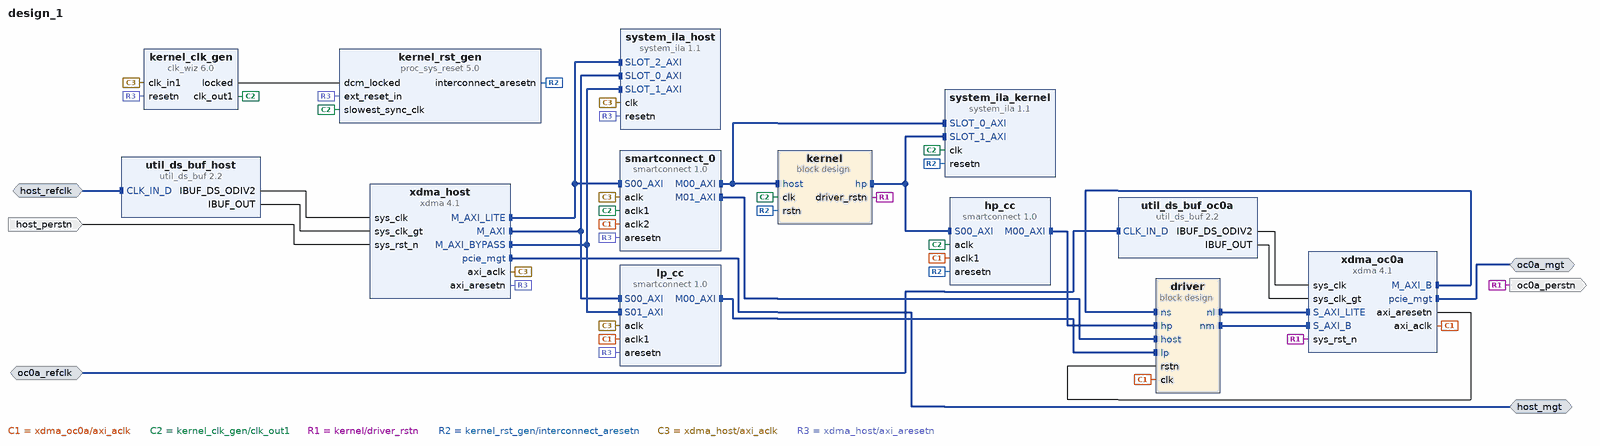
[diagram p0: block diagram of the top level]
# Vivado block design design_1, xczu19eg-ffvd1760-2-e, Vivado 2021.2
create_bd_design design_1

create_bd_intf_port -mode Slave -vlnv xilinx.com:interface:diff_clock_rtl:1.0 host_refclk
create_bd_intf_port -mode Master -vlnv xilinx.com:interface:pcie_7x_mgt_rtl:1.0 host_mgt
create_bd_intf_port -mode Slave -vlnv xilinx.com:interface:diff_clock_rtl:1.0 oc0a_refclk
create_bd_intf_port -mode Master -vlnv xilinx.com:interface:pcie_7x_mgt_rtl:1.0 oc0a_mgt
create_bd_port -dir I -type rst host_perstn
create_bd_port -dir O -type rst oc0a_perstn

create_bd_cell -type ip -vlnv xilinx.com:ip:xdma:4.1 xdma_host
set_property -dict [list \
  CONFIG.PF0_DEVICE_ID_mqdma 903F \
  CONFIG.PF0_SRIOV_VF_DEVICE_ID A03F \
  CONFIG.PF2_DEVICE_ID_mqdma 923F \
  CONFIG.PF3_DEVICE_ID_mqdma 933F \
  CONFIG.axi_bypass_64bit_en true \
  CONFIG.axi_bypass_prefetchable true \
  CONFIG.axi_data_width 512_bit \
  CONFIG.axilite_master_en true \
  CONFIG.axilite_master_size 4 \
  CONFIG.axist_bypass_en true \
  CONFIG.axist_bypass_scale Gigabytes \
  CONFIG.axist_bypass_size 64 \
  CONFIG.axisten_freq 250 \
  CONFIG.en_gt_selection true \
  CONFIG.mode_selection Advanced \
  CONFIG.pf0_device_id 903F \
  CONFIG.pl_link_cap_max_link_speed 8.0_GT/s \
  CONFIG.pl_link_cap_max_link_width X16 \
  CONFIG.plltype QPLL1 \
  CONFIG.select_quad GTH_Quad_227 \
] [get_bd_cells xdma_host]
create_bd_cell -type ip -vlnv xilinx.com:ip:util_ds_buf:2.2 util_ds_buf_host
set_property -dict {CONFIG.C_BUF_TYPE IBUFDSGTE} [get_bd_cells util_ds_buf_host]
create_bd_cell -type ip -vlnv xilinx.com:ip:xdma:4.1 xdma_oc0a
set_property -dict [list \
  CONFIG.BASEADDR 0x00000000 \
  CONFIG.HIGHADDR 0x001FFFFF \
  CONFIG.PF0_DEVICE_ID_mqdma 9034 \
  CONFIG.PF0_SRIOV_VF_DEVICE_ID A034 \
  CONFIG.PF2_DEVICE_ID_mqdma 9234 \
  CONFIG.PF3_DEVICE_ID_mqdma 9334 \
  CONFIG.axi_addr_width 32 \
  CONFIG.axi_data_width 128_bit \
  CONFIG.axisten_freq 250 \
  CONFIG.bridge_burst true \
  CONFIG.device_port_type Root_Port_of_PCI_Express_Root_Complex \
  CONFIG.dma_reset_source_sel Phy_Ready \
  CONFIG.en_gt_selection true \
  CONFIG.functional_mode AXI_Bridge \
  CONFIG.mode_selection Advanced \
  CONFIG.pcie_blk_locn X0Y3 \
  CONFIG.pf0_bar0_enabled false \
  CONFIG.pf0_bar0_type_mqdma Memory \
  CONFIG.pf0_base_class_menu Bridge_device \
  CONFIG.pf0_base_class_menu_mqdma Bridge_device \
  CONFIG.pf0_class_code_base_mqdma 06 \
  CONFIG.pf0_class_code_interface 00 \
  CONFIG.pf0_class_code_sub 07 \
  CONFIG.pf0_device_id 9134 \
  CONFIG.pf0_sriov_bar0_type Memory \
  CONFIG.pf0_sub_class_interface_menu CardBus_bridge \
  CONFIG.pf1_bar0_type_mqdma Memory \
  CONFIG.pf1_base_class_menu Bridge_device \
  CONFIG.pf1_base_class_menu_mqdma Bridge_device \
  CONFIG.pf1_class_code_base_mqdma 06 \
  CONFIG.pf1_class_code_interface 00 \
  CONFIG.pf1_class_code_sub 07 \
  CONFIG.pf1_sub_class_interface_menu CardBus_bridge \
  CONFIG.pf2_bar0_type_mqdma Memory \
  CONFIG.pf2_base_class_menu_mqdma Bridge_device \
  CONFIG.pf2_class_code_base_mqdma 06 \
  CONFIG.pf3_bar0_type_mqdma Memory \
  CONFIG.pf3_base_class_menu_mqdma Bridge_device \
  CONFIG.pf3_class_code_base_mqdma 06 \
  CONFIG.pl_link_cap_max_link_speed 8.0_GT/s \
  CONFIG.pl_link_cap_max_link_width X4 \
  CONFIG.plltype QPLL1 \
  CONFIG.select_quad GTY_Quad_131 \
  CONFIG.type1_membase_memlimit_enable Enabled \
  CONFIG.type1_prefetchable_membase_memlimit 64bit_Enabled \
] [get_bd_cells xdma_oc0a]
create_bd_cell -type ip -vlnv xilinx.com:ip:util_ds_buf:2.2 util_ds_buf_oc0a
set_property -dict {CONFIG.C_BUF_TYPE IBUFDSGTE} [get_bd_cells util_ds_buf_oc0a]
create_bd_cell -type ip -vlnv xilinx.com:ip:clk_wiz:6.0 kernel_clk_gen
set_property -dict [list \
  CONFIG.CLKOUT1_JITTER 85.152 \
  CONFIG.CLKOUT1_PHASE_ERROR 78.266 \
  CONFIG.CLKOUT1_REQUESTED_OUT_FREQ 250 \
  CONFIG.MMCM_CLKFBOUT_MULT_F 4.750 \
  CONFIG.MMCM_CLKOUT0_DIVIDE_F 4.750 \
  CONFIG.RESET_PORT resetn \
  CONFIG.RESET_TYPE ACTIVE_LOW \
  CONFIG.USE_RESET true \
] [get_bd_cells kernel_clk_gen]
create_bd_cell -type ip -vlnv xilinx.com:ip:proc_sys_reset:5.0 kernel_rst_gen
set_property -dict {CONFIG.C_EXT_RST_WIDTH 1} [get_bd_cells kernel_rst_gen]
create_bd_cell -type container -reference design_2 kernel
set_property -dict [list \
  CONFIG.ACTIVE_SIM_BD design_2.bd \
  CONFIG.ACTIVE_SYNTH_BD design_2.bd \
  CONFIG.ENABLE_DFX 0 \
  CONFIG.LIST_SIM_BD design_2.bd \
  CONFIG.LIST_SYNTH_BD design_2.bd \
  CONFIG.LOCK_PROPAGATE 0 \
] [get_bd_cells kernel]
create_bd_cell -type container -reference design_3 driver
set_property -dict [list \
  CONFIG.ACTIVE_SIM_BD design_3.bd \
  CONFIG.ACTIVE_SYNTH_BD design_3.bd \
  CONFIG.ENABLE_DFX 0 \
  CONFIG.LIST_SIM_BD design_3.bd \
  CONFIG.LIST_SYNTH_BD design_3.bd \
  CONFIG.LOCK_PROPAGATE 0 \
] [get_bd_cells driver]
create_bd_cell -type ip -vlnv xilinx.com:ip:smartconnect:1.0 lp_cc
set_property -dict {CONFIG.HAS_ARESETN 1 CONFIG.NUM_CLKS 2} [get_bd_cells lp_cc]
create_bd_cell -type ip -vlnv xilinx.com:ip:smartconnect:1.0 hp_cc
set_property -dict {CONFIG.NUM_CLKS 2 CONFIG.NUM_SI 1} [get_bd_cells hp_cc]
create_bd_cell -type ip -vlnv xilinx.com:ip:system_ila:1.1 system_ila_host
set_property -dict {CONFIG.C_NUM_MONITOR_SLOTS 3 CONFIG.C_SLOT 1} [get_bd_cells system_ila_host]
create_bd_cell -type ip -vlnv xilinx.com:ip:system_ila:1.1 system_ila_kernel
set_property -dict {CONFIG.C_NUM_MONITOR_SLOTS 2} [get_bd_cells system_ila_kernel]
create_bd_cell -type ip -vlnv xilinx.com:ip:smartconnect:1.0 smartconnect_0
set_property -dict {CONFIG.NUM_CLKS 3 CONFIG.NUM_MI 2 CONFIG.NUM_SI 1} [get_bd_cells smartconnect_0]

# ---- connections ----

connect_bd_intf_net -intf_net CLK_IN_D_0_1 [get_bd_intf_ports host_refclk] [get_bd_intf_pins util_ds_buf_host/CLK_IN_D]
connect_bd_intf_net -intf_net CLK_IN_D_0_2 [get_bd_intf_ports oc0a_refclk] [get_bd_intf_pins util_ds_buf_oc0a/CLK_IN_D]
connect_bd_intf_net -intf_net design_3_0_nl [get_bd_intf_pins driver/nl] [get_bd_intf_pins xdma_oc0a/S_AXI_LITE]
connect_bd_intf_net -intf_net design_3_0_nm [get_bd_intf_pins driver/nm] [get_bd_intf_pins xdma_oc0a/S_AXI_B]
connect_bd_intf_net -intf_net hp_cc2_M00_AXI [get_bd_intf_pins hp_cc/M00_AXI] [get_bd_intf_pins driver/hp]
connect_bd_intf_net [get_bd_intf_pins hp_cc/S00_AXI] [get_bd_intf_pins kernel/hp]
connect_bd_intf_net [get_bd_intf_pins hp_cc/S00_AXI] [get_bd_intf_pins system_ila_kernel/SLOT_1_AXI]
connect_bd_intf_net [get_bd_intf_pins driver/ns] [get_bd_intf_pins xdma_oc0a/M_AXI_B]
connect_bd_intf_net -intf_net smartconnect_0_M00_AXI [get_bd_intf_pins lp_cc/M00_AXI] [get_bd_intf_pins driver/lp]
connect_bd_intf_net [get_bd_intf_pins smartconnect_0/M00_AXI] [get_bd_intf_pins kernel/host]
connect_bd_intf_net [get_bd_intf_pins smartconnect_0/M00_AXI] [get_bd_intf_pins system_ila_kernel/SLOT_0_AXI]
connect_bd_intf_net [get_bd_intf_pins smartconnect_0/M01_AXI] [get_bd_intf_pins driver/host]
connect_bd_intf_net -intf_net xdma_0_pcie_mgt [get_bd_intf_ports host_mgt] [get_bd_intf_pins xdma_host/pcie_mgt]
connect_bd_intf_net -intf_net xdma_1_pcie_mgt [get_bd_intf_ports oc0a_mgt] [get_bd_intf_pins xdma_oc0a/pcie_mgt]
connect_bd_intf_net [get_bd_intf_pins lp_cc/S00_AXI] [get_bd_intf_pins xdma_host/M_AXI]
connect_bd_intf_net [get_bd_intf_pins lp_cc/S00_AXI] [get_bd_intf_pins system_ila_host/SLOT_0_AXI]
connect_bd_intf_net [get_bd_intf_pins lp_cc/S01_AXI] [get_bd_intf_pins xdma_host/M_AXI_BYPASS]
connect_bd_intf_net [get_bd_intf_pins lp_cc/S01_AXI] [get_bd_intf_pins system_ila_host/SLOT_1_AXI]
connect_bd_intf_net [get_bd_intf_pins smartconnect_0/S00_AXI] [get_bd_intf_pins xdma_host/M_AXI_LITE]
connect_bd_intf_net [get_bd_intf_pins smartconnect_0/S00_AXI] [get_bd_intf_pins system_ila_host/SLOT_2_AXI]
connect_bd_net -net clk_1 [get_bd_pins xdma_oc0a/axi_aclk] \
  [get_bd_pins driver/clk] [get_bd_pins lp_cc/aclk1] [get_bd_pins hp_cc/aclk1] [get_bd_pins smartconnect_0/aclk2]
connect_bd_net -net clk_wiz_0_clk_out1 [get_bd_pins kernel_clk_gen/clk_out1] \
  [get_bd_pins kernel_rst_gen/slowest_sync_clk] [get_bd_pins kernel/clk] [get_bd_pins hp_cc/aclk] \
  [get_bd_pins system_ila_kernel/clk] [get_bd_pins smartconnect_0/aclk1]
connect_bd_net -net clk_wiz_0_locked [get_bd_pins kernel_clk_gen/locked] [get_bd_pins kernel_rst_gen/dcm_locked]
connect_bd_net -net kernel_wrapper_0_driver_rstn [get_bd_pins kernel/driver_rstn] [get_bd_ports oc0a_perstn] [get_bd_pins xdma_oc0a/sys_rst_n]
connect_bd_net -net proc_sys_reset_0_interconnect_aresetn [get_bd_pins kernel_rst_gen/interconnect_aresetn] \
  [get_bd_pins kernel/rstn] [get_bd_pins hp_cc/aresetn] [get_bd_pins system_ila_kernel/resetn]
connect_bd_net -net rstn_1 [get_bd_pins xdma_oc0a/axi_aresetn] [get_bd_pins driver/rstn]
connect_bd_net -net sys_rst_n_0_1 [get_bd_ports host_perstn] [get_bd_pins xdma_host/sys_rst_n]
connect_bd_net -net util_ds_buf_0_IBUF_DS_ODIV2 [get_bd_pins util_ds_buf_host/IBUF_DS_ODIV2] [get_bd_pins xdma_host/sys_clk]
connect_bd_net -net util_ds_buf_0_IBUF_OUT [get_bd_pins util_ds_buf_host/IBUF_OUT] [get_bd_pins xdma_host/sys_clk_gt]
connect_bd_net -net util_ds_buf_1_IBUF_DS_ODIV2 [get_bd_pins util_ds_buf_oc0a/IBUF_DS_ODIV2] [get_bd_pins xdma_oc0a/sys_clk]
connect_bd_net -net util_ds_buf_1_IBUF_OUT [get_bd_pins util_ds_buf_oc0a/IBUF_OUT] [get_bd_pins xdma_oc0a/sys_clk_gt]
connect_bd_net -net xdma_0_axi_aclk [get_bd_pins xdma_host/axi_aclk] \
  [get_bd_pins kernel_clk_gen/clk_in1] [get_bd_pins lp_cc/aclk] [get_bd_pins system_ila_host/clk] \
  [get_bd_pins smartconnect_0/aclk]
connect_bd_net -net xdma_0_axi_aresetn [get_bd_pins xdma_host/axi_aresetn] \
  [get_bd_pins kernel_rst_gen/ext_reset_in] [get_bd_pins kernel_clk_gen/resetn] [get_bd_pins lp_cc/aresetn] \
  [get_bd_pins system_ila_host/resetn] [get_bd_pins smartconnect_0/aresetn]

# ---- address map ----
assign_bd_address -offset 0x000800000 -range 2M -target_address_space [get_bd_addr_spaces driver/driver_wrapper_0/rdbuf] [get_bd_addr_segs driver/rdbuf_ctrl/S_AXI/Mem0]
exclude_bd_addr_seg -offset 0x000000000 -range 2M -target_address_space [get_bd_addr_spaces driver/driver_wrapper_0/rdbuf] [get_bd_addr_segs driver/wrsq_ctrl/S_AXI/Mem0]
exclude_bd_addr_seg -offset 0x000200000 -range 2M -target_address_space [get_bd_addr_spaces driver/driver_wrapper_0/rdbuf] [get_bd_addr_segs driver/wrbuf_ctrl/S_AXI/Mem0]
exclude_bd_addr_seg -offset 0x000400000 -range 2M -target_address_space [get_bd_addr_spaces driver/driver_wrapper_0/rdbuf] [get_bd_addr_segs driver/wrcq_ctrl/S_AXI/Mem0]
exclude_bd_addr_seg -offset 0x000600000 -range 2M -target_address_space [get_bd_addr_spaces driver/driver_wrapper_0/rdbuf] [get_bd_addr_segs driver/rdsq_ctrl/S_AXI/Mem0]
exclude_bd_addr_seg -offset 0x000A00000 -range 2M -target_address_space [get_bd_addr_spaces driver/driver_wrapper_0/rdbuf] [get_bd_addr_segs driver/rdcq_ctrl/S_AXI/Mem0]
exclude_bd_addr_seg -offset 0x000C00000 -range 2M -target_address_space [get_bd_addr_spaces driver/driver_wrapper_0/rdbuf] [get_bd_addr_segs driver/adbuf_ctrl/S_AXI/Mem0]
exclude_bd_addr_seg -offset 0x200000000 -range 4G -target_address_space [get_bd_addr_spaces driver/driver_wrapper_0/rdbuf] [get_bd_addr_segs xdma_oc0a/S_AXI_LITE/CTL0]
exclude_bd_addr_seg -offset 0x300000000 -range 4G -target_address_space [get_bd_addr_spaces driver/driver_wrapper_0/rdbuf] [get_bd_addr_segs xdma_oc0a/S_AXI_B/BAR0]
assign_bd_address -offset 0x000A00000 -range 2M -target_address_space [get_bd_addr_spaces driver/driver_wrapper_0/rdcq] [get_bd_addr_segs driver/rdcq_ctrl/S_AXI/Mem0]
exclude_bd_addr_seg -offset 0x000000000 -range 2M -target_address_space [get_bd_addr_spaces driver/driver_wrapper_0/rdcq] [get_bd_addr_segs driver/wrsq_ctrl/S_AXI/Mem0]
exclude_bd_addr_seg -offset 0x000200000 -range 2M -target_address_space [get_bd_addr_spaces driver/driver_wrapper_0/rdcq] [get_bd_addr_segs driver/wrbuf_ctrl/S_AXI/Mem0]
exclude_bd_addr_seg -offset 0x000400000 -range 2M -target_address_space [get_bd_addr_spaces driver/driver_wrapper_0/rdcq] [get_bd_addr_segs driver/wrcq_ctrl/S_AXI/Mem0]
exclude_bd_addr_seg -offset 0x000600000 -range 2M -target_address_space [get_bd_addr_spaces driver/driver_wrapper_0/rdcq] [get_bd_addr_segs driver/rdsq_ctrl/S_AXI/Mem0]
exclude_bd_addr_seg -offset 0x000800000 -range 2M -target_address_space [get_bd_addr_spaces driver/driver_wrapper_0/rdcq] [get_bd_addr_segs driver/rdbuf_ctrl/S_AXI/Mem0]
exclude_bd_addr_seg -offset 0x000C00000 -range 2M -target_address_space [get_bd_addr_spaces driver/driver_wrapper_0/rdcq] [get_bd_addr_segs driver/adbuf_ctrl/S_AXI/Mem0]
exclude_bd_addr_seg -offset 0x200000000 -range 4G -target_address_space [get_bd_addr_spaces driver/driver_wrapper_0/rdcq] [get_bd_addr_segs xdma_oc0a/S_AXI_LITE/CTL0]
exclude_bd_addr_seg -offset 0x300000000 -range 4G -target_address_space [get_bd_addr_spaces driver/driver_wrapper_0/rdcq] [get_bd_addr_segs xdma_oc0a/S_AXI_B/BAR0]
assign_bd_address -offset 0x300000000 -range 4G -target_address_space [get_bd_addr_spaces driver/driver_wrapper_0/rdcqdb] [get_bd_addr_segs xdma_oc0a/S_AXI_B/BAR0]
exclude_bd_addr_seg -offset 0x000000000 -range 2M -target_address_space [get_bd_addr_spaces driver/driver_wrapper_0/rdcqdb] [get_bd_addr_segs driver/wrsq_ctrl/S_AXI/Mem0]
exclude_bd_addr_seg -offset 0x000200000 -range 2M -target_address_space [get_bd_addr_spaces driver/driver_wrapper_0/rdcqdb] [get_bd_addr_segs driver/wrbuf_ctrl/S_AXI/Mem0]
exclude_bd_addr_seg -offset 0x000400000 -range 2M -target_address_space [get_bd_addr_spaces driver/driver_wrapper_0/rdcqdb] [get_bd_addr_segs driver/wrcq_ctrl/S_AXI/Mem0]
exclude_bd_addr_seg -offset 0x000600000 -range 2M -target_address_space [get_bd_addr_spaces driver/driver_wrapper_0/rdcqdb] [get_bd_addr_segs driver/rdsq_ctrl/S_AXI/Mem0]
exclude_bd_addr_seg -offset 0x000800000 -range 2M -target_address_space [get_bd_addr_spaces driver/driver_wrapper_0/rdcqdb] [get_bd_addr_segs driver/rdbuf_ctrl/S_AXI/Mem0]
exclude_bd_addr_seg -offset 0x000A00000 -range 2M -target_address_space [get_bd_addr_spaces driver/driver_wrapper_0/rdcqdb] [get_bd_addr_segs driver/rdcq_ctrl/S_AXI/Mem0]
exclude_bd_addr_seg -offset 0x000C00000 -range 2M -target_address_space [get_bd_addr_spaces driver/driver_wrapper_0/rdcqdb] [get_bd_addr_segs driver/adbuf_ctrl/S_AXI/Mem0]
exclude_bd_addr_seg -offset 0x200000000 -range 4G -target_address_space [get_bd_addr_spaces driver/driver_wrapper_0/rdcqdb] [get_bd_addr_segs xdma_oc0a/S_AXI_LITE/CTL0]
assign_bd_address -offset 0x000600000 -range 2M -target_address_space [get_bd_addr_spaces driver/driver_wrapper_0/rdsq] [get_bd_addr_segs driver/rdsq_ctrl/S_AXI/Mem0]
exclude_bd_addr_seg -offset 0x000000000 -range 2M -target_address_space [get_bd_addr_spaces driver/driver_wrapper_0/rdsq] [get_bd_addr_segs driver/wrsq_ctrl/S_AXI/Mem0]
exclude_bd_addr_seg -offset 0x000200000 -range 2M -target_address_space [get_bd_addr_spaces driver/driver_wrapper_0/rdsq] [get_bd_addr_segs driver/wrbuf_ctrl/S_AXI/Mem0]
exclude_bd_addr_seg -offset 0x000400000 -range 2M -target_address_space [get_bd_addr_spaces driver/driver_wrapper_0/rdsq] [get_bd_addr_segs driver/wrcq_ctrl/S_AXI/Mem0]
exclude_bd_addr_seg -offset 0x000800000 -range 2M -target_address_space [get_bd_addr_spaces driver/driver_wrapper_0/rdsq] [get_bd_addr_segs driver/rdbuf_ctrl/S_AXI/Mem0]
exclude_bd_addr_seg -offset 0x000A00000 -range 2M -target_address_space [get_bd_addr_spaces driver/driver_wrapper_0/rdsq] [get_bd_addr_segs driver/rdcq_ctrl/S_AXI/Mem0]
exclude_bd_addr_seg -offset 0x000C00000 -range 2M -target_address_space [get_bd_addr_spaces driver/driver_wrapper_0/rdsq] [get_bd_addr_segs driver/adbuf_ctrl/S_AXI/Mem0]
exclude_bd_addr_seg -offset 0x200000000 -range 4G -target_address_space [get_bd_addr_spaces driver/driver_wrapper_0/rdsq] [get_bd_addr_segs xdma_oc0a/S_AXI_LITE/CTL0]
exclude_bd_addr_seg -offset 0x300000000 -range 4G -target_address_space [get_bd_addr_spaces driver/driver_wrapper_0/rdsq] [get_bd_addr_segs xdma_oc0a/S_AXI_B/BAR0]
assign_bd_address -offset 0x300000000 -range 4G -target_address_space [get_bd_addr_spaces driver/driver_wrapper_0/rdsqdb] [get_bd_addr_segs xdma_oc0a/S_AXI_B/BAR0]
exclude_bd_addr_seg -offset 0x000000000 -range 2M -target_address_space [get_bd_addr_spaces driver/driver_wrapper_0/rdsqdb] [get_bd_addr_segs driver/wrsq_ctrl/S_AXI/Mem0]
exclude_bd_addr_seg -offset 0x000200000 -range 2M -target_address_space [get_bd_addr_spaces driver/driver_wrapper_0/rdsqdb] [get_bd_addr_segs driver/wrbuf_ctrl/S_AXI/Mem0]
exclude_bd_addr_seg -offset 0x000400000 -range 2M -target_address_space [get_bd_addr_spaces driver/driver_wrapper_0/rdsqdb] [get_bd_addr_segs driver/wrcq_ctrl/S_AXI/Mem0]
exclude_bd_addr_seg -offset 0x000600000 -range 2M -target_address_space [get_bd_addr_spaces driver/driver_wrapper_0/rdsqdb] [get_bd_addr_segs driver/rdsq_ctrl/S_AXI/Mem0]
exclude_bd_addr_seg -offset 0x000800000 -range 2M -target_address_space [get_bd_addr_spaces driver/driver_wrapper_0/rdsqdb] [get_bd_addr_segs driver/rdbuf_ctrl/S_AXI/Mem0]
exclude_bd_addr_seg -offset 0x000A00000 -range 2M -target_address_space [get_bd_addr_spaces driver/driver_wrapper_0/rdsqdb] [get_bd_addr_segs driver/rdcq_ctrl/S_AXI/Mem0]
exclude_bd_addr_seg -offset 0x000C00000 -range 2M -target_address_space [get_bd_addr_spaces driver/driver_wrapper_0/rdsqdb] [get_bd_addr_segs driver/adbuf_ctrl/S_AXI/Mem0]
exclude_bd_addr_seg -offset 0x200000000 -range 4G -target_address_space [get_bd_addr_spaces driver/driver_wrapper_0/rdsqdb] [get_bd_addr_segs xdma_oc0a/S_AXI_LITE/CTL0]
assign_bd_address -offset 0x000200000 -range 2M -target_address_space [get_bd_addr_spaces driver/driver_wrapper_0/wrbuf] [get_bd_addr_segs driver/wrbuf_ctrl/S_AXI/Mem0]
exclude_bd_addr_seg -offset 0x000000000 -range 2M -target_address_space [get_bd_addr_spaces driver/driver_wrapper_0/wrbuf] [get_bd_addr_segs driver/wrsq_ctrl/S_AXI/Mem0]
exclude_bd_addr_seg -offset 0x000400000 -range 2M -target_address_space [get_bd_addr_spaces driver/driver_wrapper_0/wrbuf] [get_bd_addr_segs driver/wrcq_ctrl/S_AXI/Mem0]
exclude_bd_addr_seg -offset 0x000600000 -range 2M -target_address_space [get_bd_addr_spaces driver/driver_wrapper_0/wrbuf] [get_bd_addr_segs driver/rdsq_ctrl/S_AXI/Mem0]
exclude_bd_addr_seg -offset 0x000800000 -range 2M -target_address_space [get_bd_addr_spaces driver/driver_wrapper_0/wrbuf] [get_bd_addr_segs driver/rdbuf_ctrl/S_AXI/Mem0]
exclude_bd_addr_seg -offset 0x000A00000 -range 2M -target_address_space [get_bd_addr_spaces driver/driver_wrapper_0/wrbuf] [get_bd_addr_segs driver/rdcq_ctrl/S_AXI/Mem0]
exclude_bd_addr_seg -offset 0x000C00000 -range 2M -target_address_space [get_bd_addr_spaces driver/driver_wrapper_0/wrbuf] [get_bd_addr_segs driver/adbuf_ctrl/S_AXI/Mem0]
exclude_bd_addr_seg -offset 0x200000000 -range 4G -target_address_space [get_bd_addr_spaces driver/driver_wrapper_0/wrbuf] [get_bd_addr_segs xdma_oc0a/S_AXI_LITE/CTL0]
exclude_bd_addr_seg -offset 0x300000000 -range 4G -target_address_space [get_bd_addr_spaces driver/driver_wrapper_0/wrbuf] [get_bd_addr_segs xdma_oc0a/S_AXI_B/BAR0]
assign_bd_address -offset 0x000400000 -range 2M -target_address_space [get_bd_addr_spaces driver/driver_wrapper_0/wrcq] [get_bd_addr_segs driver/wrcq_ctrl/S_AXI/Mem0]
exclude_bd_addr_seg -offset 0x000000000 -range 2M -target_address_space [get_bd_addr_spaces driver/driver_wrapper_0/wrcq] [get_bd_addr_segs driver/wrsq_ctrl/S_AXI/Mem0]
exclude_bd_addr_seg -offset 0x000200000 -range 2M -target_address_space [get_bd_addr_spaces driver/driver_wrapper_0/wrcq] [get_bd_addr_segs driver/wrbuf_ctrl/S_AXI/Mem0]
exclude_bd_addr_seg -offset 0x000600000 -range 2M -target_address_space [get_bd_addr_spaces driver/driver_wrapper_0/wrcq] [get_bd_addr_segs driver/rdsq_ctrl/S_AXI/Mem0]
exclude_bd_addr_seg -offset 0x000800000 -range 2M -target_address_space [get_bd_addr_spaces driver/driver_wrapper_0/wrcq] [get_bd_addr_segs driver/rdbuf_ctrl/S_AXI/Mem0]
exclude_bd_addr_seg -offset 0x000A00000 -range 2M -target_address_space [get_bd_addr_spaces driver/driver_wrapper_0/wrcq] [get_bd_addr_segs driver/rdcq_ctrl/S_AXI/Mem0]
exclude_bd_addr_seg -offset 0x000C00000 -range 2M -target_address_space [get_bd_addr_spaces driver/driver_wrapper_0/wrcq] [get_bd_addr_segs driver/adbuf_ctrl/S_AXI/Mem0]
exclude_bd_addr_seg -offset 0x200000000 -range 4G -target_address_space [get_bd_addr_spaces driver/driver_wrapper_0/wrcq] [get_bd_addr_segs xdma_oc0a/S_AXI_LITE/CTL0]
exclude_bd_addr_seg -offset 0x300000000 -range 4G -target_address_space [get_bd_addr_spaces driver/driver_wrapper_0/wrcq] [get_bd_addr_segs xdma_oc0a/S_AXI_B/BAR0]
assign_bd_address -offset 0x300000000 -range 4G -target_address_space [get_bd_addr_spaces driver/driver_wrapper_0/wrcqdb] [get_bd_addr_segs xdma_oc0a/S_AXI_B/BAR0]
exclude_bd_addr_seg -offset 0x000000000 -range 2M -target_address_space [get_bd_addr_spaces driver/driver_wrapper_0/wrcqdb] [get_bd_addr_segs driver/wrsq_ctrl/S_AXI/Mem0]
exclude_bd_addr_seg -offset 0x000200000 -range 2M -target_address_space [get_bd_addr_spaces driver/driver_wrapper_0/wrcqdb] [get_bd_addr_segs driver/wrbuf_ctrl/S_AXI/Mem0]
exclude_bd_addr_seg -offset 0x000400000 -range 2M -target_address_space [get_bd_addr_spaces driver/driver_wrapper_0/wrcqdb] [get_bd_addr_segs driver/wrcq_ctrl/S_AXI/Mem0]
exclude_bd_addr_seg -offset 0x000600000 -range 2M -target_address_space [get_bd_addr_spaces driver/driver_wrapper_0/wrcqdb] [get_bd_addr_segs driver/rdsq_ctrl/S_AXI/Mem0]
exclude_bd_addr_seg -offset 0x000800000 -range 2M -target_address_space [get_bd_addr_spaces driver/driver_wrapper_0/wrcqdb] [get_bd_addr_segs driver/rdbuf_ctrl/S_AXI/Mem0]
exclude_bd_addr_seg -offset 0x000A00000 -range 2M -target_address_space [get_bd_addr_spaces driver/driver_wrapper_0/wrcqdb] [get_bd_addr_segs driver/rdcq_ctrl/S_AXI/Mem0]
exclude_bd_addr_seg -offset 0x000C00000 -range 2M -target_address_space [get_bd_addr_spaces driver/driver_wrapper_0/wrcqdb] [get_bd_addr_segs driver/adbuf_ctrl/S_AXI/Mem0]
exclude_bd_addr_seg -offset 0x200000000 -range 4G -target_address_space [get_bd_addr_spaces driver/driver_wrapper_0/wrcqdb] [get_bd_addr_segs xdma_oc0a/S_AXI_LITE/CTL0]
assign_bd_address -offset 0x000000000 -range 2M -target_address_space [get_bd_addr_spaces driver/driver_wrapper_0/wrsq] [get_bd_addr_segs driver/wrsq_ctrl/S_AXI/Mem0]
exclude_bd_addr_seg -offset 0x000200000 -range 2M -target_address_space [get_bd_addr_spaces driver/driver_wrapper_0/wrsq] [get_bd_addr_segs driver/wrbuf_ctrl/S_AXI/Mem0]
exclude_bd_addr_seg -offset 0x000400000 -range 2M -target_address_space [get_bd_addr_spaces driver/driver_wrapper_0/wrsq] [get_bd_addr_segs driver/wrcq_ctrl/S_AXI/Mem0]
exclude_bd_addr_seg -offset 0x000600000 -range 2M -target_address_space [get_bd_addr_spaces driver/driver_wrapper_0/wrsq] [get_bd_addr_segs driver/rdsq_ctrl/S_AXI/Mem0]
exclude_bd_addr_seg -offset 0x000800000 -range 2M -target_address_space [get_bd_addr_spaces driver/driver_wrapper_0/wrsq] [get_bd_addr_segs driver/rdbuf_ctrl/S_AXI/Mem0]
exclude_bd_addr_seg -offset 0x000A00000 -range 2M -target_address_space [get_bd_addr_spaces driver/driver_wrapper_0/wrsq] [get_bd_addr_segs driver/rdcq_ctrl/S_AXI/Mem0]
exclude_bd_addr_seg -offset 0x000C00000 -range 2M -target_address_space [get_bd_addr_spaces driver/driver_wrapper_0/wrsq] [get_bd_addr_segs driver/adbuf_ctrl/S_AXI/Mem0]
exclude_bd_addr_seg -offset 0x200000000 -range 4G -target_address_space [get_bd_addr_spaces driver/driver_wrapper_0/wrsq] [get_bd_addr_segs xdma_oc0a/S_AXI_LITE/CTL0]
exclude_bd_addr_seg -offset 0x300000000 -range 4G -target_address_space [get_bd_addr_spaces driver/driver_wrapper_0/wrsq] [get_bd_addr_segs xdma_oc0a/S_AXI_B/BAR0]
assign_bd_address -offset 0x300000000 -range 4G -target_address_space [get_bd_addr_spaces driver/driver_wrapper_0/wrsqdb] [get_bd_addr_segs xdma_oc0a/S_AXI_B/BAR0]
exclude_bd_addr_seg -offset 0x000000000 -range 2M -target_address_space [get_bd_addr_spaces driver/driver_wrapper_0/wrsqdb] [get_bd_addr_segs driver/wrsq_ctrl/S_AXI/Mem0]
exclude_bd_addr_seg -offset 0x000200000 -range 2M -target_address_space [get_bd_addr_spaces driver/driver_wrapper_0/wrsqdb] [get_bd_addr_segs driver/wrbuf_ctrl/S_AXI/Mem0]
exclude_bd_addr_seg -offset 0x000400000 -range 2M -target_address_space [get_bd_addr_spaces driver/driver_wrapper_0/wrsqdb] [get_bd_addr_segs driver/wrcq_ctrl/S_AXI/Mem0]
exclude_bd_addr_seg -offset 0x000600000 -range 2M -target_address_space [get_bd_addr_spaces driver/driver_wrapper_0/wrsqdb] [get_bd_addr_segs driver/rdsq_ctrl/S_AXI/Mem0]
exclude_bd_addr_seg -offset 0x000800000 -range 2M -target_address_space [get_bd_addr_spaces driver/driver_wrapper_0/wrsqdb] [get_bd_addr_segs driver/rdbuf_ctrl/S_AXI/Mem0]
exclude_bd_addr_seg -offset 0x000A00000 -range 2M -target_address_space [get_bd_addr_spaces driver/driver_wrapper_0/wrsqdb] [get_bd_addr_segs driver/rdcq_ctrl/S_AXI/Mem0]
exclude_bd_addr_seg -offset 0x000C00000 -range 2M -target_address_space [get_bd_addr_spaces driver/driver_wrapper_0/wrsqdb] [get_bd_addr_segs driver/adbuf_ctrl/S_AXI/Mem0]
exclude_bd_addr_seg -offset 0x200000000 -range 4G -target_address_space [get_bd_addr_spaces driver/driver_wrapper_0/wrsqdb] [get_bd_addr_segs xdma_oc0a/S_AXI_LITE/CTL0]
assign_bd_address -offset 0x000000000000 -range 256T -target_address_space [get_bd_addr_spaces kernel/kernel_wrapper_0/hp] [get_bd_addr_segs driver/driver_wrapper_0/hp/reg0]
assign_bd_address -offset 0x0000000000000000 -range 2M -target_address_space [get_bd_addr_spaces xdma_host/M_AXI] [get_bd_addr_segs driver/wrsq_ctrl/S_AXI/Mem0]
assign_bd_address -offset 0x0000000000200000 -range 2M -target_address_space [get_bd_addr_spaces xdma_host/M_AXI] [get_bd_addr_segs driver/wrbuf_ctrl/S_AXI/Mem0]
assign_bd_address -offset 0x0000000000400000 -range 2M -target_address_space [get_bd_addr_spaces xdma_host/M_AXI] [get_bd_addr_segs driver/wrcq_ctrl/S_AXI/Mem0]
assign_bd_address -offset 0x0000000000600000 -range 2M -target_address_space [get_bd_addr_spaces xdma_host/M_AXI] [get_bd_addr_segs driver/rdsq_ctrl/S_AXI/Mem0]
assign_bd_address -offset 0x0000000000800000 -range 2M -target_address_space [get_bd_addr_spaces xdma_host/M_AXI] [get_bd_addr_segs driver/rdbuf_ctrl/S_AXI/Mem0]
assign_bd_address -offset 0x0000000000A00000 -range 2M -target_address_space [get_bd_addr_spaces xdma_host/M_AXI] [get_bd_addr_segs driver/rdcq_ctrl/S_AXI/Mem0]
assign_bd_address -offset 0x0000000000C00000 -range 2M -target_address_space [get_bd_addr_spaces xdma_host/M_AXI] [get_bd_addr_segs driver/adbuf_ctrl/S_AXI/Mem0]
assign_bd_address -offset 0x0000000200000000 -range 4G -target_address_space [get_bd_addr_spaces xdma_host/M_AXI] [get_bd_addr_segs xdma_oc0a/S_AXI_LITE/CTL0]
assign_bd_address -offset 0x0000000300000000 -range 4G -target_address_space [get_bd_addr_spaces xdma_host/M_AXI] [get_bd_addr_segs xdma_oc0a/S_AXI_B/BAR0]
assign_bd_address -offset 0x0000000000000000 -range 2M -target_address_space [get_bd_addr_spaces xdma_host/M_AXI_BYPASS] [get_bd_addr_segs driver/wrsq_ctrl/S_AXI/Mem0]
assign_bd_address -offset 0x0000000000200000 -range 2M -target_address_space [get_bd_addr_spaces xdma_host/M_AXI_BYPASS] [get_bd_addr_segs driver/wrbuf_ctrl/S_AXI/Mem0]
assign_bd_address -offset 0x0000000000400000 -range 2M -target_address_space [get_bd_addr_spaces xdma_host/M_AXI_BYPASS] [get_bd_addr_segs driver/wrcq_ctrl/S_AXI/Mem0]
assign_bd_address -offset 0x0000000000600000 -range 2M -target_address_space [get_bd_addr_spaces xdma_host/M_AXI_BYPASS] [get_bd_addr_segs driver/rdsq_ctrl/S_AXI/Mem0]
assign_bd_address -offset 0x0000000000800000 -range 2M -target_address_space [get_bd_addr_spaces xdma_host/M_AXI_BYPASS] [get_bd_addr_segs driver/rdbuf_ctrl/S_AXI/Mem0]
assign_bd_address -offset 0x0000000000A00000 -range 2M -target_address_space [get_bd_addr_spaces xdma_host/M_AXI_BYPASS] [get_bd_addr_segs driver/rdcq_ctrl/S_AXI/Mem0]
assign_bd_address -offset 0x0000000000C00000 -range 2M -target_address_space [get_bd_addr_spaces xdma_host/M_AXI_BYPASS] [get_bd_addr_segs driver/adbuf_ctrl/S_AXI/Mem0]
assign_bd_address -offset 0x0000000200000000 -range 4G -target_address_space [get_bd_addr_spaces xdma_host/M_AXI_BYPASS] [get_bd_addr_segs xdma_oc0a/S_AXI_LITE/CTL0]
assign_bd_address -offset 0x0000000300000000 -range 4G -target_address_space [get_bd_addr_spaces xdma_host/M_AXI_BYPASS] [get_bd_addr_segs xdma_oc0a/S_AXI_B/BAR0]
assign_bd_address -offset 0x00000000 -range 2M -target_address_space [get_bd_addr_spaces xdma_host/M_AXI_LITE] [get_bd_addr_segs kernel/kernel_wrapper_0/host/reg0]
assign_bd_address -offset 0x00200000 -range 2M -target_address_space [get_bd_addr_spaces xdma_host/M_AXI_LITE] [get_bd_addr_segs driver/driver_wrapper_0/host/reg0]
assign_bd_address -offset 0x000000000 -range 2M -target_address_space [get_bd_addr_spaces xdma_oc0a/M_AXI_B] [get_bd_addr_segs driver/wrsq_ctrl/S_AXI/Mem0]
assign_bd_address -offset 0x000200000 -range 2M -target_address_space [get_bd_addr_spaces xdma_oc0a/M_AXI_B] [get_bd_addr_segs driver/wrbuf_ctrl/S_AXI/Mem0]
assign_bd_address -offset 0x000400000 -range 2M -target_address_space [get_bd_addr_spaces xdma_oc0a/M_AXI_B] [get_bd_addr_segs driver/wrcq_ctrl/S_AXI/Mem0]
assign_bd_address -offset 0x000600000 -range 2M -target_address_space [get_bd_addr_spaces xdma_oc0a/M_AXI_B] [get_bd_addr_segs driver/rdsq_ctrl/S_AXI/Mem0]
assign_bd_address -offset 0x000800000 -range 2M -target_address_space [get_bd_addr_spaces xdma_oc0a/M_AXI_B] [get_bd_addr_segs driver/rdbuf_ctrl/S_AXI/Mem0]
assign_bd_address -offset 0x000A00000 -range 2M -target_address_space [get_bd_addr_spaces xdma_oc0a/M_AXI_B] [get_bd_addr_segs driver/rdcq_ctrl/S_AXI/Mem0]
assign_bd_address -offset 0x000C00000 -range 2M -target_address_space [get_bd_addr_spaces xdma_oc0a/M_AXI_B] [get_bd_addr_segs driver/adbuf_ctrl/S_AXI/Mem0]
exclude_bd_addr_seg -offset 0x010000000 -range 256M -target_address_space [get_bd_addr_spaces xdma_oc0a/M_AXI_B] [get_bd_addr_segs xdma_oc0a/S_AXI_LITE/CTL0]
exclude_bd_addr_seg -offset 0x300000000 -range 4G -target_address_space [get_bd_addr_spaces xdma_oc0a/M_AXI_B] [get_bd_addr_segs xdma_oc0a/S_AXI_B/BAR0]

validate_bd_design
save_bd_design
